# EAGLE design qcopter_rfm_bb (EAGLE 7.5.0)
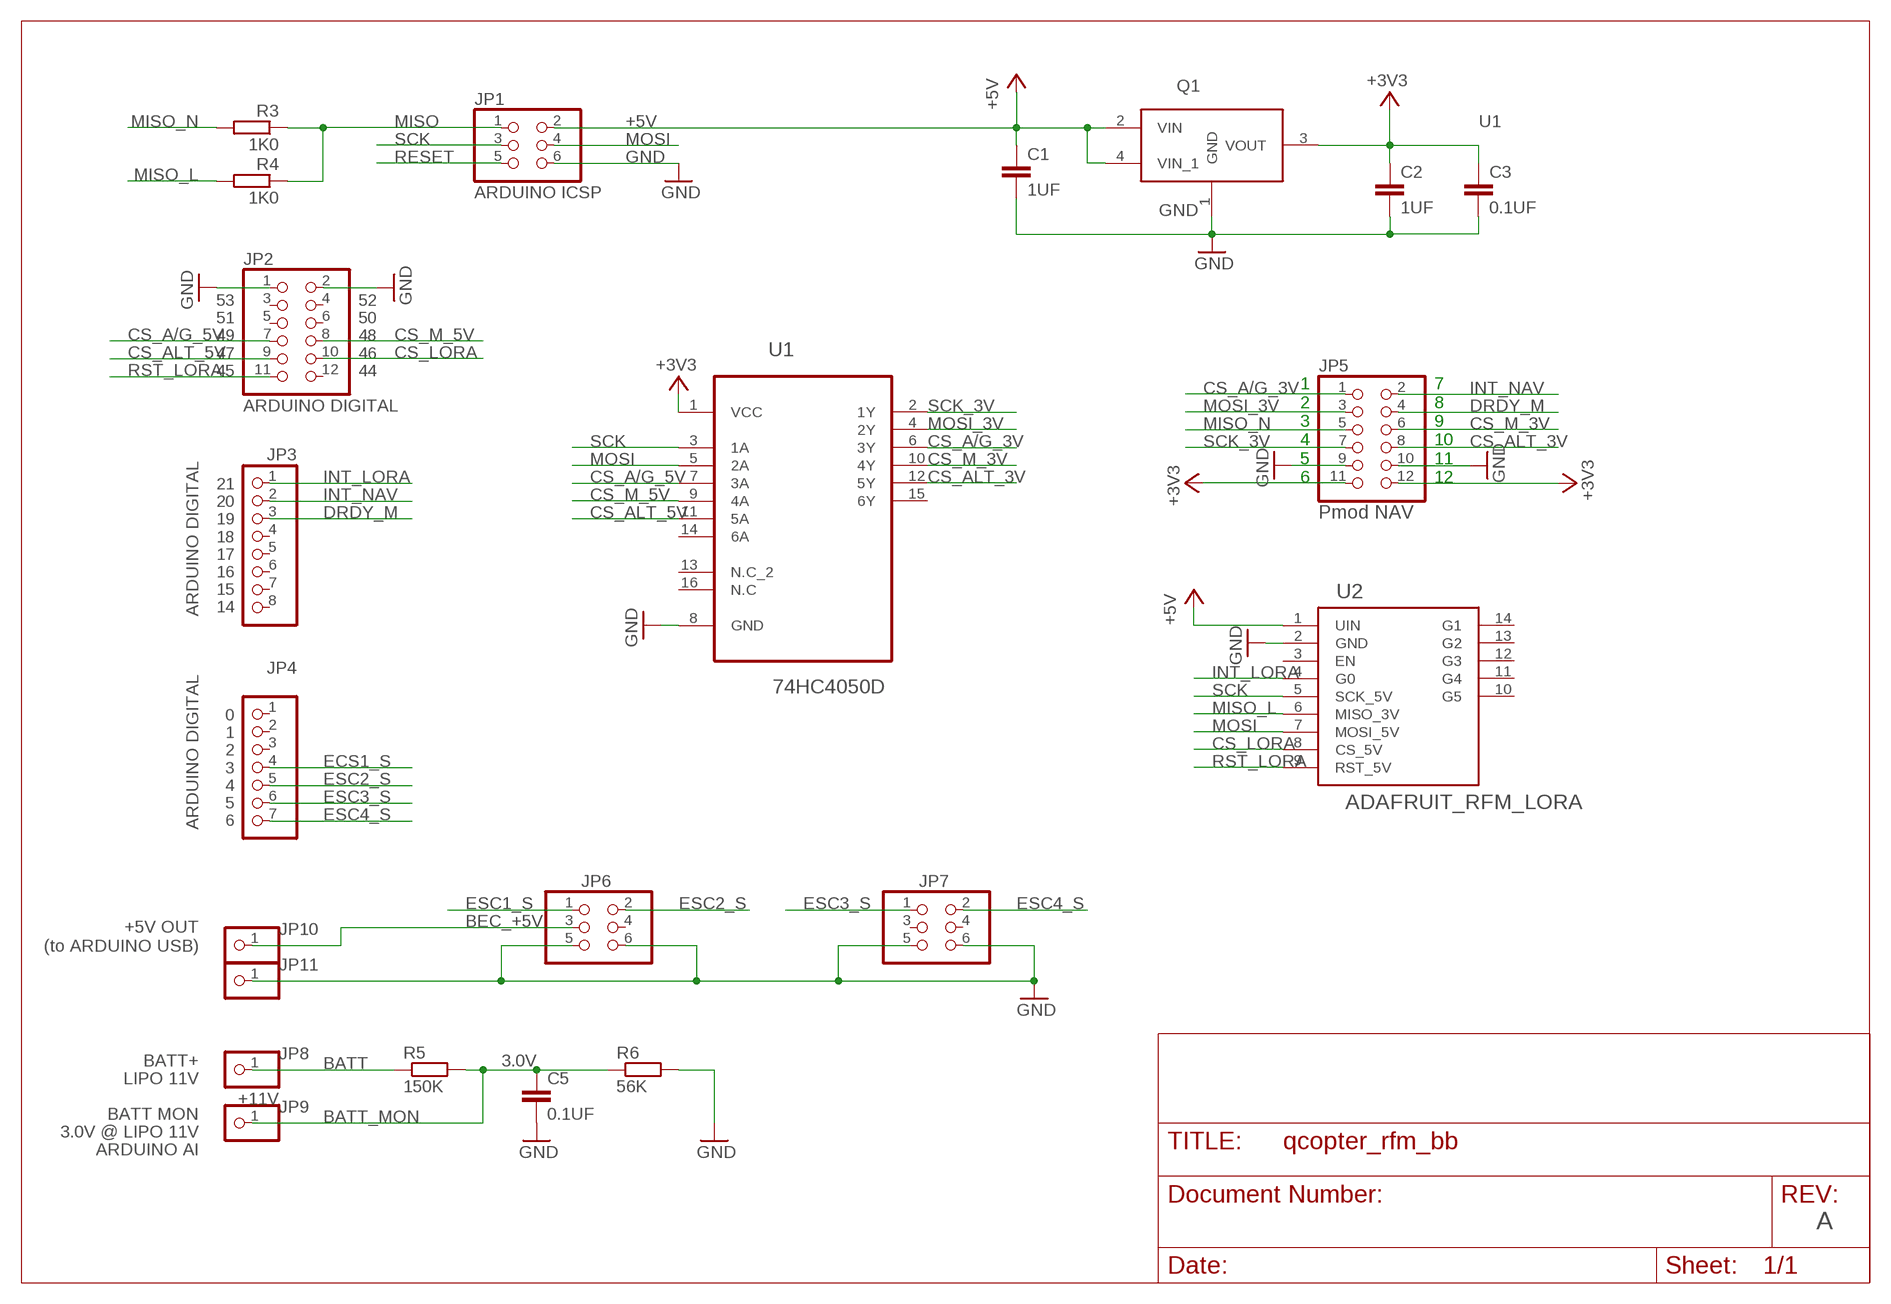
[diagram p0: schematic, sheet 1]

## Parts
C1  1UF  C-EUC1206  [C1206]
C2  1UF  C-EUC1206  [C1206]
C3  0.1UF  C-EUC1206  [C1206]
C5  0.1UF  C-EUC1206  [C1206]
JP1  ARDUINO ICSP  PINHD-2X3  [2X03]
JP2  ARDUINO DIGITAL  PINHD-2X6  [2X06]
JP3  ARDUINO DIGITAL  PINHD-1X8  [1X08]
JP4  ARDUINO DIGITAL  PINHD-1X7  [1X07]
JP5  Pmod NAV  PINHD-2X6/90  [2X06/90]
JP6  PINHD-2X3  [2X03]
JP7  PINHD-2X3  [2X03]
JP8  +11V  PINHD-1X1  [1X01]
JP9  PINHD-1X1  [1X01]
JP10  PINHD-1X1  [1X01]
JP11  PINHD-1X1  [1X01]
Q1  MCP17-MCP1703T-3302E/MB  [SOT150P400X160-4N]
R3  1K0  R-EU_R1206  [R1206]
R4  1K0  R-EU_R1206  [R1206]
R5  150K  R-EU_R1206  [R1206]
R6  56K  R-EU_R1206  [R1206]
U1  74HC4050D  [SOIC127P600X175-16N]
U2  ADAFRUIT_RFM_LORA  [ADAFRUIT_RFM_LORA_B]

## Nets
+3V3: C2.1 C3.1 JP5.11 JP5.12 Q1.3(VOUT) U1.1(VCC)
+5V: C1.1 JP1.2 Q1.2(VIN) Q1.4(VIN_1) U2.1(UIN)
BATT: JP8.1 R5.1
BATT_MON: C5.1 JP9.1 R5.2 R6.1
BEC_+5V: JP6.3 JP10.1
CS_A/G_3V: JP5.1 U1.6(3Y)
CS_A/G_5V: JP2.7 U1.7(3A)
CS_ALT_3V: JP5.8 U1.12(5Y)
CS_ALT_5V: JP2.9 U1.11(5A)
CS_LORA: JP2.10 U2.8(CS_5V)
CS_M_3V: JP5.6 U1.10(4Y)
CS_M_5V: JP2.8 U1.9(4A)
DRDY_M: JP3.3 JP5.4
ECS1_S: JP4.4
ESC1_S: JP6.1
ESC2_S: JP4.5 JP6.2
ESC3_S: JP4.6 JP7.1
ESC4_S: JP4.7 JP7.2
GND: C1.2 C2.2 C3.2 C5.2 JP1.6 JP2.1 JP2.2 JP5.9 JP5.10 JP6.5 JP6.6 JP7.5 JP7.6 JP11.1 Q1.1(GND) R6.2 U1.8(GND) U2.2(GND)
INT_LORA: JP3.1 U2.4(G0)
INT_NAV: JP3.2 JP5.2
MISO: JP1.1 R3.1 R4.1
MISO_L: R4.2 U2.6(MISO_3V)
MISO_N: JP5.5 R3.2
MOSI: JP1.4 U1.5(2A) U2.7(MOSI_5V)
MOSI_3V: JP5.3 U1.4(2Y)
RESET: JP1.5
RST_LORA: JP2.11 U2.9(RST_5V)
SCK: JP1.3 U1.3(1A) U2.5(SCK_5V)
SCK_3V: JP5.7 U1.2(1Y)
Unconnected: JP2.3 JP2.4 JP2.5 JP2.6 JP2.12 JP3.4 JP3.5 JP3.6 JP3.7 JP3.8 JP4.1 JP4.2 JP4.3 JP6.4 JP7.3 JP7.4 U1.13(N.C_2) U1.14(6A) U1.15(6Y) U1.16(N.C) U2.3(EN) U2.10(G5) U2.11(G4) U2.12(G3) U2.13(G2) U2.14(G1)

## Notes on the sheet
- U1
- 53
  51
  49
  47
  45
- 52
  50
  48
  46
  44
- 1
  2
  3
  4
  5
  6
- 7
  8
  9
  10
  11
  12
- 21
  20
  19
  18
  17
  16
  15
  14
- 0
  1
  2
  3
  4
  5
  6
- +5V OUT
  (to ARDUINO USB)
- BATT+ | 3.0V
- LIPO 11V
- BATT MON
- 3.0V @ LIPO 11V
- ARDUINO AI
- A

## Library data of the parts
C1-C3 C5 = resistor:C-EU: CAPACITOR, European symbol
JP1 JP6 JP7 = pinhead:PINHD-2X3: PIN HEADER
JP2 JP5 = pinhead:PINHD-2X6: PIN HEADER
JP3 = pinhead:PINHD-1X8: PIN HEADER
JP4 = pinhead:PINHD-1X7: PIN HEADER
JP8-JP11 = pinhead:PINHD-1X1: PIN HEADER
Q1 = Microchip-MCP170xxxx_MB:MCP17: Low Quiescent Current LDO Regulator; MPN: MCP1703T-3302E/MB; OC_FARNELL: 1851952; OC_NEWARK: 40M0639; PACKAGE: SOT89-3; SUPPLIER: Microchip
R3-R6 = resistor:R-EU_: RESISTOR, European symbol
U1 = 74HC4050_SOIC-16:74HC4050D: Hex high-to-low level shifter; MPN: 74HC4050D; OC_FARNELL: 1085272; OC_NEWARK: -; PACKAGE: SOIC-16; SUPPLIER: NXP
U2 = Adafruit_RFM_LoRa:ADAFRUIT_RFM_LORA: Adafruit RFM+LoRa Breakout

## Board
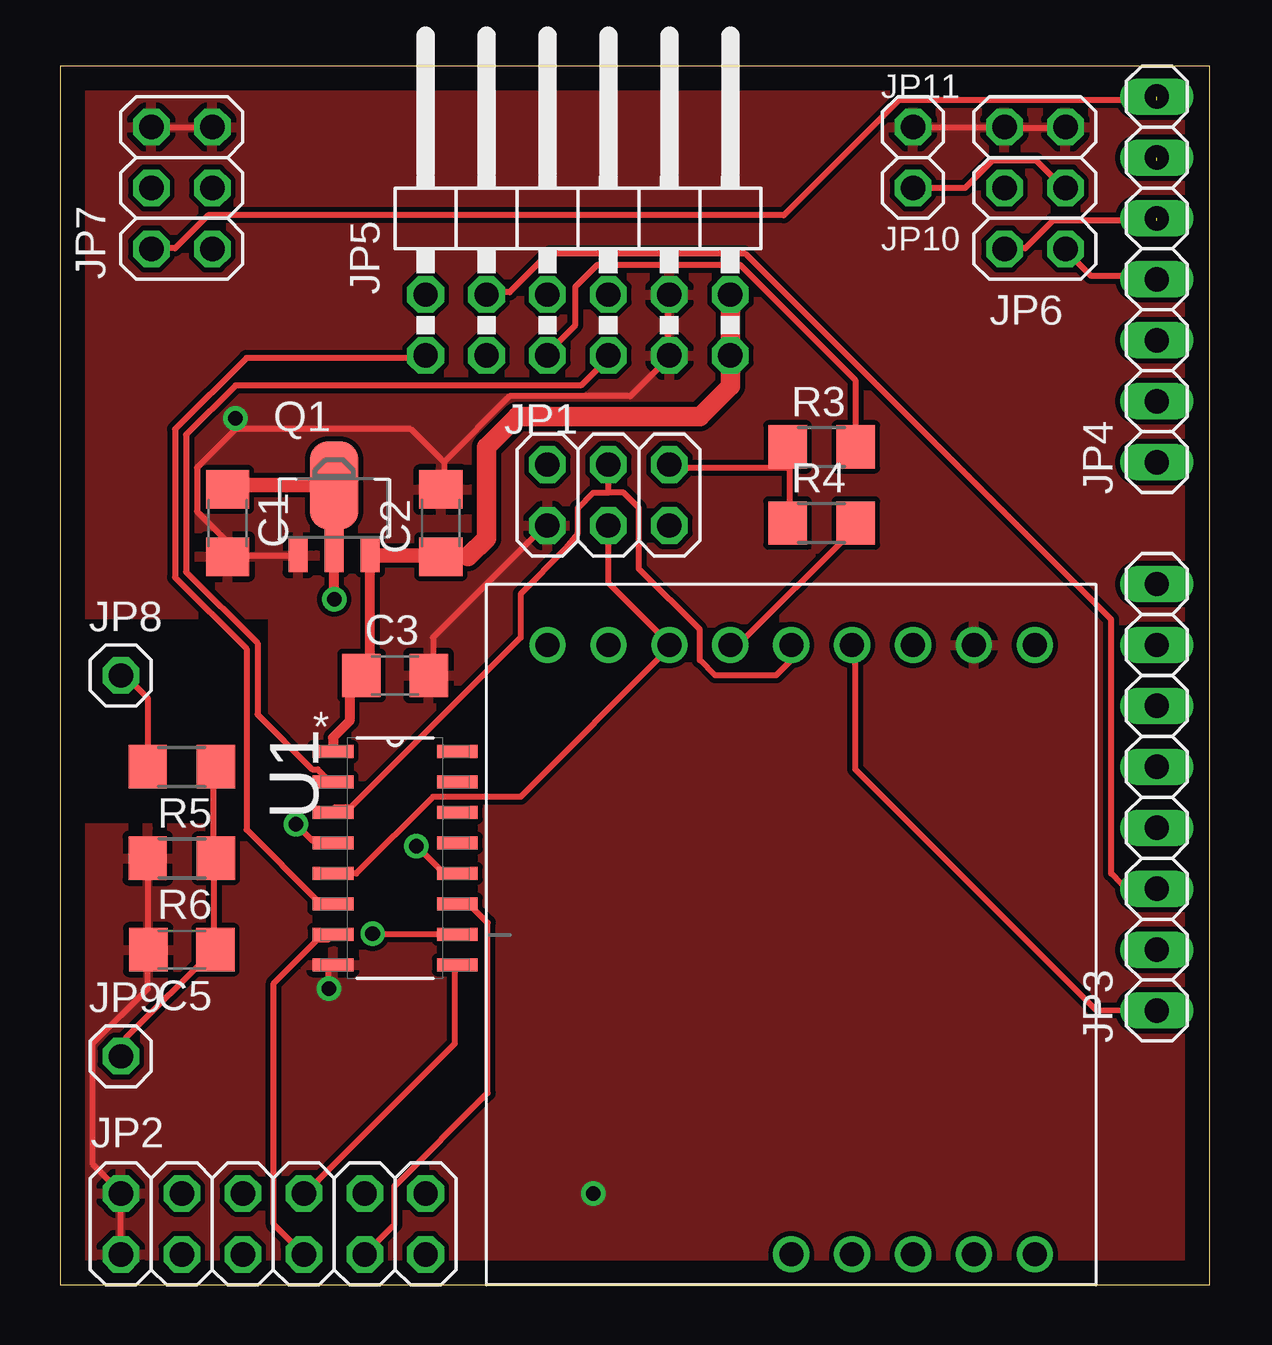
[diagram p1: board, top side]
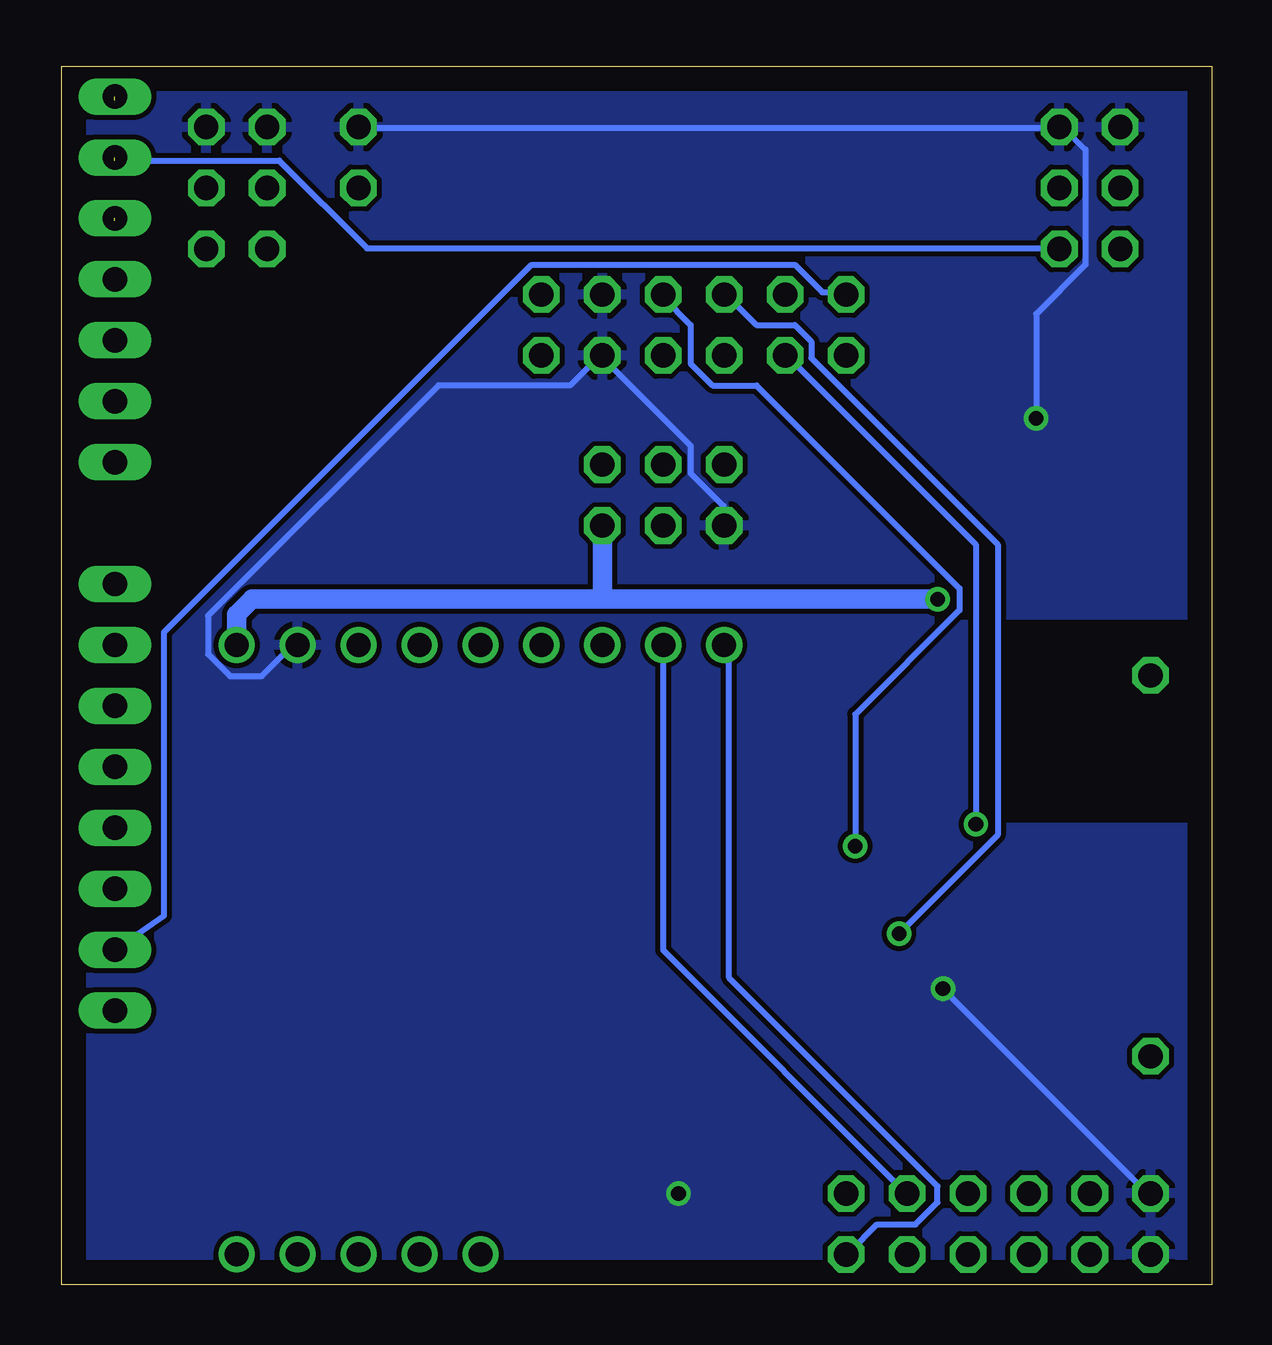
[diagram p2: board, bottom side, seen from below]

Size 47.93 x 50.79 mm. Coordinates in mm from the lower left corner, seen from the top.
Outline: 0,0 47.93,0 47.93,50.79 0,50.79 0,0
Copper layers (1*16): Top 0.035mm / dielectric 1.5mm / Bottom 0.035mm
Design rules "default": minimum track width 10mil, minimum drill 24mil, track to track 8mil, track to pad 8mil, pad to pad 8mil, via to via 8mil, smd to smd 8mil, copper to edge 40mil, drill to drill 8mil, minimum pad ring 10mil, minimum via ring 8mil, stop-mask expansion 4mil, vias tented up to drill 0mil, thermal gap 10mil

### Footprints (pad centres in the part's own frame; a part is rotated, then mirrored left to right if it is on the bottom)
C1206 = smd 1.6 x 1.8: 1 -1.4,0; 2 1.4,0
2X03 = drill 1.016 octagon: 1 -2.54,-1.27; 2 -2.54,1.27; 3 0,-1.27; 4 0,1.27; 5 2.54,-1.27; 6 2.54,1.27
2X06 = drill 1.016 octagon: 1 -6.35,-1.27; 2 -6.35,1.27; 3 -3.81,-1.27; 4 -3.81,1.27; 5 -1.27,-1.27; 6 -1.27,1.27; 7 1.27,-1.27; 8 1.27,1.27; 9 3.81,-1.27; 10 3.81,1.27; 11 6.35,-1.27; 12 6.35,1.27
1X08 = drill 1.016 long: 1 -8.89,0; 2 -6.35,0; 3 -3.81,0; 4 -1.27,0; 5 1.27,0; 6 3.81,0; 7 6.35,0; 8 8.89,0
1X07 = drill 1.016 long: 1 -7.62,0; 2 -5.08,0; 3 -2.54,0; 4 0,0; 5 2.54,0; 6 5.08,0; 7 7.62,0
2X06/90 = drill 1.016 octagon: 1 -6.35,-6.35; 2 -6.35,-3.81; 3 -3.81,-6.35; 4 -3.81,-3.81; 5 -1.27,-6.35; 6 -1.27,-3.81; 7 1.27,-6.35; 8 1.27,-3.81; 9 3.81,-6.35; 10 3.81,-3.81; 11 6.35,-6.35; 12 6.35,-3.81
1X01 = drill 1.016 octagon: 1 0,0
SOT150P400X160-4N = smd 0.8 x 1.4: 1 -1.499,-1.981; 3 1.499,-1.981 | smd 0.8 x 1.9: 2 0,-1.727 | smd 2.032 x 3.65: 4 0,0.94
R1206 = smd 1.6 x 1.803: 1 -1.422,0; 2 1.422,0
SOIC127P600X175-16N = smd 1.702 x 0.533: 1 -2.591,4.445; 2 -2.591,3.175; 3 -2.591,1.905; 4 -2.591,0.635; 5 -2.591,-0.635; 6 -2.591,-1.905; 7 -2.591,-3.175; 8 -2.591,-4.445; 9 2.591,-4.445; 10 2.591,-3.175; 11 2.591,-1.905; 12 2.591,-0.635; 13 2.591,0.635; 14 2.591,1.905; 15 2.591,3.175; 16 2.591,4.445
ADAFRUIT_RFM_LORA_B = drill 1: 1 -12.7,12.7; 2 -12.7,10.16; 3 -12.7,7.62; 4 -12.7,5.08; 5 -12.7,2.54; 6 -12.7,0; 7 -12.7,-2.54; 8 -12.7,-5.08; 9 -12.7,-7.62; 10 12.7,2.54; 11 12.7,5.08; 12 12.7,7.62; 13 12.7,10.16; 14 12.7,12.7

### Placement (x,y rotation side)
C1  6.99,31.75 270 top
C2  15.88,31.75 90 top
C3  13.97,25.4 0 top
C5  5.08,13.97 180 top
JP1  22.86,32.92 180 top
JP2  8.89,2.54 0 top
JP3  45.72,20.32 90 top
JP4  45.72,41.91 90 top
JP5  21.59,45.09 0 top
JP6  40.64,45.72 90 top
JP7  5.08,45.72 90 top
JP8  2.54,25.4 0 top
JP9  2.54,9.53 0 top
JP10  35.56,45.72 0 top
JP11  35.56,48.26 0 top
Q1  11.43,32.38 0 top
R3  31.75,34.92 0 top
R4  31.75,31.75 0 top
R5  5.08,21.59 0 top
R6  5.08,17.78 180 top
U1  13.97,17.78 0 top
U2  27.94,13.97 270 top

### Tracks (layer width: path | path; a pad name or v marks a point on that pad's centre or on a via)
+3V3
  Top 0.406: U1.1 11.38,22.81 12.06,23.5 12.06,24.89 C3.1 12.93,25.76 Q1.3
  Top 0.61: Q1.3 15.82,30.4 C2.1 17.02,30.35
  Top 0.813: 17.02,30.35 17.78,31.11 17.78,34.92 19.05,36.2 26.67,36.2 27.94,37.47 JP5.11 JP5.12
+5V  (via drill 0.61)
  Top 0.254: Q1.2 Q1.4
  Top 0.406: v11.43,28.57 Q1.2
  Top 0.61: C1.1 7.16,33.33 Q1.4
  Bottom 0.813: U2.1 40.64,27.94 40.01,28.57 25.4,28.57 | JP1.2 25.4,28.57 | v11.43,28.57 25.4,28.57
BATT
  Top 0.254: R5.1 3.66,21.72 3.66,24.46 2.74,25.38 JP8.1
BATT_MON
  Top 0.254: R5.2 6.4,21.49 6.4,17.83 R6.1 6.4,17.6 6.4,14.17 C5.1 6.4,13.95 2.74,10.29 2.74,9.6 JP9.1
BEC_+5V
  Top 0.254: JP10.1 37.72,45.72 38.86,46.86 40.69,46.86 41.83,45.72 JP6.3
CS_A/G_3V
  Top 0.254: U1.6 11.2,16 10.74,16 7.77,18.97 7.77,26.52 4.8,29.49 4.8,35.66 7.77,38.63 15.09,38.63 JP5.1
CS_A/G_5V
  Top 0.254: JP2.7 8.91,2.52 8.91,12.57 10.74,14.4 11.2,14.4 U1.7
CS_ALT_3V  (via drill 0.61)
  Top 0.254: U1.12 16,17.14 v14.86,18.29
  Bottom 0.254: v14.86,18.29 14.86,23.77 10.52,28.12 10.52,29.03 18.97,37.49 20.8,37.49 21.72,38.41 21.72,40.01 22.86,41.15 JP5.8
CS_ALT_5V
  Top 0.254: JP2.9 13.95,2.52 13.95,4.12 17.83,8 17.83,15.09 17.14,15.77 16.69,15.77 U1.11
CS_LORA
  Bottom 0.254: U2.8 22.86,13.95 12.8,3.89 JP2.10
CS_M_3V  (via drill 0.61)
  Top 0.254: v13.03,14.63 16.46,14.63 U1.10
  Bottom 0.254: v13.03,14.63 8.91,18.75 8.91,30.86 16.69,38.63 16.69,39.32 17.37,40.01 18.97,40.01 20.12,41.15 JP5.6
CS_M_5V
  Top 0.254: U1.9 16.46,13.26 16.46,10.06 10.29,3.89 JP2.8
DRDY_M
  Top 0.254: JP5.4 17.83,41.38 18.75,41.38 20.34,42.98 28.57,42.98 43.81,27.74 43.81,17.14 44.25,16.71 45.52,16.71 JP3.3
ESC1_S
  Top 0.254: 45.72,42.06 42.98,42.06 42.06,42.98 JP6.1
ESC2_S  (1 unrouted)
  Top 0.254: 45.72,44.35 41.38,44.35 40.23,43.2 39.55,43.2 JP6.2
ESC3_S  (1 unrouted)
  Bottom 0.254: 45.72,46.86 38.86,46.86 35.2,43.2 6.4,43.2 JP7.1
ESC4_S  (1 unrouted)
  Top 0.254: 45.72,49.38 34.98,49.38 30.18,44.58 6.17,44.58 4.8,43.2 3.89,43.2 JP7.2
GND  (via drill 0.61)
  Top 0.254: C3.2 15.54,25.6 15.54,26.98 20.12,31.55 JP1.6 | Q1.1 9.83,30.4 7.09,30.4 C1.2 6.86,30.4 6.86,31.09 5.71,32.23 5.71,34.06 7.32,35.66 | 16,34.29 16,33.38 C2.2 | 16,34.29 18.75,37.03 23.77,37.03 25.38,38.63 JP5.9 25.38,38.86 25.38,41.15 JP5.10 | 7.32,35.66 14.63,35.66 16,34.29 | v11.2,12.34 11.2,13.26 U1.8 | JP2.1 2.52,1.37 2.52,3.66 JP2.2 2.52,3.89 1.37,5.03 1.37,10.06 3.66,12.34 3.66,13.95 C5.2 3.66,14.17 3.66,17.6 R6.2 3.66,17.83 | JP7.5 6.17,48.23 3.89,48.23 JP7.6 3.66,48.23 | JP11.1 35.66,48.23 39.32,48.23 JP6.6 39.55,48.23 41.83,48.23 JP6.5 | v7.32,36.12 7.32,35.66
  Bottom 0.254: U2.2 38.18,26.52 38.46,26.52 39.6,25.38 40.92,25.38 41.83,26.29 41.83,27.89 32.23,37.49 26.75,37.49 25.6,38.63 JP5.9 25.38,38.63 21.72,34.98 21.72,33.83 20.34,32.46 20.34,31.77 JP1.6 | v11.2,12.34 2.74,3.89 JP2.2 | JP11.1 35.43,48.23 6.4,48.23 JP7.5 6.17,48.23 5.26,47.32 5.26,42.52 7.32,40.46 v7.32,36.12
  other vias: 22.23,3.81
  pour Top: 0,0 0,19.05 8.89,19.05 8.89,27.94 0,27.94 0,50.8 47.62,50.8 47.62,0
  pour Bottom: 0,0 0,19.05 8.89,19.05 8.89,27.94 0,27.94 0,50.8 47.62,50.8 47.62,0
INT_LORA
  Top 0.254: U2.4 33.15,26.52 33.15,21.49 43.18,11.46 JP3.1
INT_NAV
  Bottom 0.254: JP3.2 43.66,15.39 43.66,27.2 28.35,42.52 17.37,42.52 16.23,41.38 15.32,41.38 JP5.2
MISO
  Top 0.254: 30.4,34.06 30.4,34.75 R3.1 30.4,34.06 | 30.4,34.06 30.4,31.77 R4.1 | 30.4,34.06 25.6,34.06 JP1.1
MISO_L
  Top 0.254: R4.2 33.15,31.55 28.12,26.52 U2.6
MISO_N
  Top 0.254: R3.2 33.15,34.98 33.15,37.72 28.35,42.52 22.4,42.52 21.49,41.6 21.49,40.01 20.34,38.86 JP5.5
MOSI
  Top 0.254: U1.5 12.34,17.14 15.54,20.34 19.2,20.34 25.38,26.52 U2.7 25.38,26.75 22.86,29.26 JP1.4
MOSI_3V  (via drill 0.61)
  Top 0.254: v9.83,19.2 10.52,18.52 11.2,18.52 U1.4
  Bottom 0.254: v9.83,19.2 9.83,30.86 17.6,38.63 JP5.3
RST_LORA
  Bottom 0.254: U2.9 20.12,26.52 20.12,12.8 11.43,4.12 11.43,3.43 12.34,2.52 13.95,2.52 15.09,1.37 JP2.11
SCK
  Top 0.254: U1.3 11.43,19.89 12.12,19.89 19.2,26.98 19.2,28.8 21.08,30.68 21.59,31.32 21.59,32.38 22.23,33.02 22.86,33.02 | 22.86,34.06 JP1.3 22.86,33.02 | U2.5 30.48,26.04 29.84,25.4 27.3,25.4 26.67,26.04 26.67,27.3 24.13,29.84 24.13,32.38 23.5,33.02 22.86,33.02
SCK_3V
  Top 0.254: U1.2 11.2,21.03 10.74,21.49 10.52,21.49 8.23,23.77 8.23,26.75 5.26,29.72 5.26,35.43 7.32,37.49 21.72,37.49 22.86,38.63 JP5.7

### Text on the board
tDocu: GND | GND | +5V | +5V | S | S | BATT+ | BATT MON